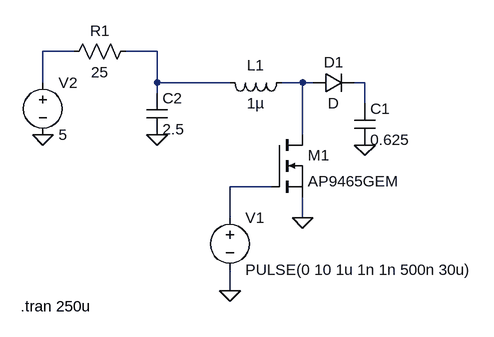
[diagram p0: schematic boost.asc]
boost.asc, the LTspice schematic file:
Version 4
SHEET 1 880 680
WIRE -96 80 -144 80
WIRE 32 80 -16 80
WIRE -144 128 -144 80
WIRE 32 128 32 80
WIRE 144 128 32 128
WIRE 256 128 224 128
WIRE 272 128 256 128
WIRE 352 128 336 128
WIRE 32 144 32 128
WIRE 352 160 352 128
WIRE 256 208 256 128
WIRE 208 288 144 288
WIRE 144 336 144 288
WIRE 256 336 256 304
WIRE 144 448 144 416
FLAG 256 336 0
FLAG 144 448 0
FLAG -144 208 0
FLAG 32 208 0
FLAG 352 224 0
SYMBOL ind 240 112 R90
WINDOW 0 5 56 VBottom 2
WINDOW 3 32 56 VTop 2
SYMATTR InstName L1
SYMATTR Value 1µ
SYMBOL cap 336 160 R0
SYMATTR InstName C1
SYMATTR Value 0.625
SYMBOL cap 16 144 R0
SYMATTR InstName C2
SYMATTR Value 2.5
SYMBOL diode 272 144 R270
WINDOW 0 32 32 VTop 2
WINDOW 3 0 32 VBottom 2
SYMATTR InstName D1
SYMBOL nmos 208 208 R0
SYMATTR InstName M1
SYMATTR Value AP9465GEM
SYMBOL voltage 144 320 R0
WINDOW 123 0 0 Left 0
WINDOW 39 0 0 Left 0
SYMATTR InstName V1
SYMATTR Value PULSE(0 10 1u 1n 1n 500n 30u)
SYMBOL voltage -144 112 R0
WINDOW 123 0 0 Left 0
WINDOW 39 0 0 Left 0
SYMATTR InstName V2
SYMATTR Value 5
SYMBOL res 0 64 R90
WINDOW 0 0 56 VBottom 2
WINDOW 3 32 56 VTop 2
SYMATTR InstName R1
SYMATTR Value 25
TEXT -178 472 Left 2 !.tran 250u

The netlist it stands for:
* boost.asc
L1 N003 N002 1µ
C1 N004 0 0.625
C2 N002 0 2.5
D1 N003 N004 D
M1 N003 N005 0 0 AP9465GEM
V1 N005 0 PULSE(0 10 1u 1n 1n 500n 30u)
V2 N001 0 5
R1 N002 N001 25
.model D D
.lib standard.dio
.model NMOS NMOS
.model PMOS PMOS
.lib standard.mos
.tran 250u
.backanno
.end